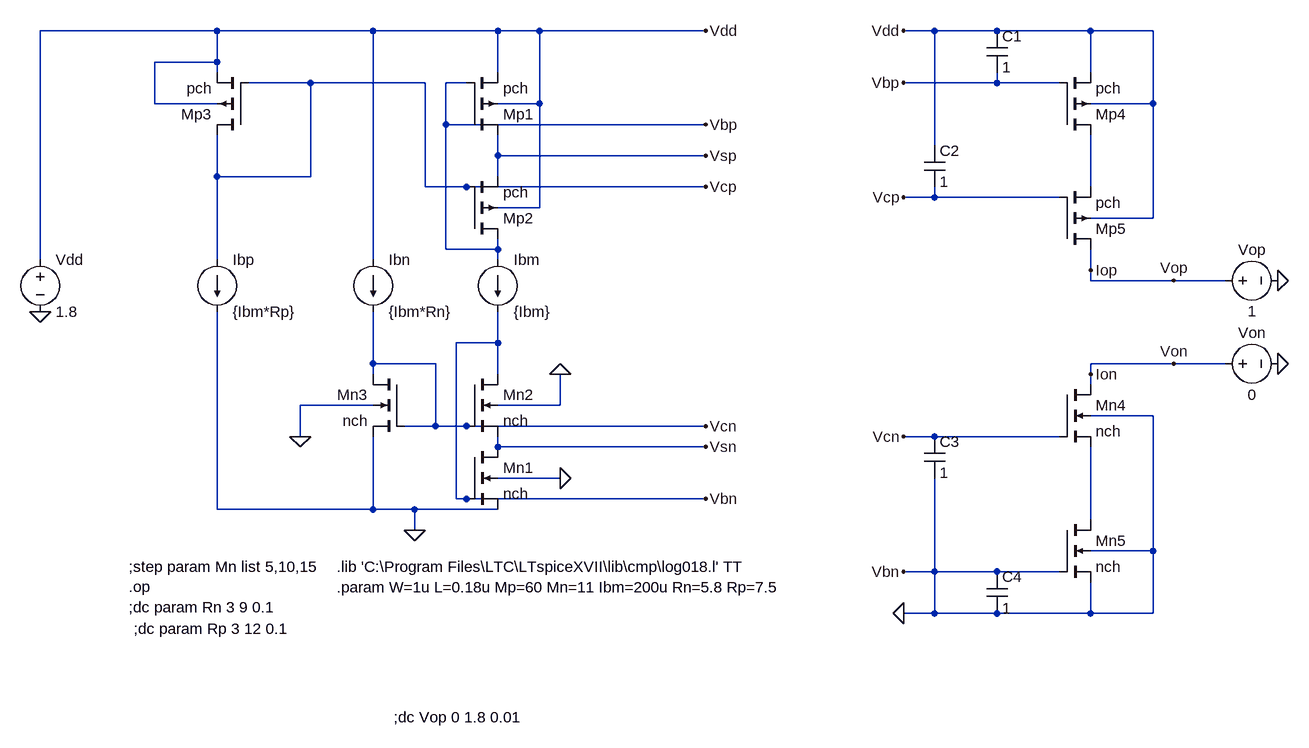
[diagram p0: schematic Simulation_1.asc]
Simulation_1.asc, the LTspice schematic file:
Version 4
SHEET 1 2628 800
WIRE 976 -272 704 -272
WIRE 1216 -272 976 -272
WIRE 1408 -272 1216 -272
WIRE 1472 -272 1408 -272
WIRE 1728 -272 1472 -272
WIRE 2080 -272 2032 -272
WIRE 2176 -272 2080 -272
WIRE 2320 -272 2176 -272
WIRE 2416 -272 2320 -272
WIRE 976 -224 976 -272
WIRE 976 -224 880 -224
WIRE 976 -208 976 -224
WIRE 1408 -208 1408 -272
WIRE 2320 -208 2320 -272
WIRE 1120 -192 1024 -192
WIRE 1296 -192 1120 -192
WIRE 1360 -192 1328 -192
WIRE 2176 -192 2176 -208
WIRE 2176 -192 2032 -192
WIRE 2272 -192 2176 -192
WIRE 880 -160 880 -224
WIRE 976 -160 880 -160
WIRE 1472 -160 1472 -272
WIRE 1472 -160 1408 -160
WIRE 2416 -160 2416 -272
WIRE 2416 -160 2320 -160
WIRE 1328 -128 1328 -192
WIRE 1728 -128 1328 -128
WIRE 2080 -96 2080 -272
WIRE 1408 -80 1408 -112
WIRE 1728 -80 1408 -80
WIRE 976 -48 976 -112
WIRE 1120 -48 1120 -192
WIRE 1120 -48 976 -48
WIRE 1408 -48 1408 -80
WIRE 1296 -32 1296 -192
WIRE 1360 -32 1296 -32
WIRE 1728 -32 1360 -32
WIRE 2320 -32 2320 -112
WIRE 2080 -16 2080 -32
WIRE 2080 -16 2032 -16
WIRE 2272 -16 2080 -16
WIRE 1472 0 1472 -160
WIRE 1472 0 1408 0
WIRE 2416 16 2416 -160
WIRE 2416 16 2320 16
WIRE 1328 64 1328 -128
WIRE 1408 64 1408 48
WIRE 1408 64 1328 64
WIRE 704 80 704 -272
WIRE 976 80 976 -48
WIRE 1216 80 1216 -272
WIRE 1408 80 1408 64
WIRE 2320 96 2320 64
WIRE 2320 112 2320 96
WIRE 2448 112 2320 112
WIRE 2528 112 2448 112
WIRE 1408 208 1408 160
WIRE 1408 208 1344 208
WIRE 1216 240 1216 160
WIRE 1312 240 1216 240
WIRE 2448 240 2320 240
WIRE 2528 240 2448 240
WIRE 1216 256 1216 240
WIRE 1408 256 1408 208
WIRE 2320 256 2320 240
WIRE 2320 272 2320 256
WIRE 1216 304 1104 304
WIRE 1504 304 1504 256
WIRE 1504 304 1408 304
WIRE 2416 320 2320 320
WIRE 1312 336 1312 240
WIRE 1312 336 1264 336
WIRE 1360 336 1312 336
WIRE 1728 336 1360 336
WIRE 1104 352 1104 304
WIRE 2080 352 2032 352
WIRE 2272 352 2080 352
WIRE 1408 368 1408 352
WIRE 1728 368 1408 368
WIRE 1504 416 1408 416
WIRE 1344 448 1344 208
WIRE 1360 448 1344 448
WIRE 1728 448 1360 448
WIRE 976 464 976 160
WIRE 1216 464 1216 352
WIRE 1216 464 976 464
WIRE 1280 464 1216 464
WIRE 1408 464 1280 464
WIRE 2320 480 2320 368
WIRE 1280 496 1280 464
WIRE 2416 528 2416 320
WIRE 2416 528 2320 528
WIRE 2080 560 2080 416
WIRE 2080 560 2032 560
WIRE 2176 560 2080 560
WIRE 2272 560 2176 560
WIRE 2080 624 2080 560
WIRE 2080 624 2032 624
WIRE 2176 624 2080 624
WIRE 2320 624 2320 576
WIRE 2320 624 2176 624
WIRE 2416 624 2416 528
WIRE 2416 624 2320 624
FLAG 704 160 0
FLAG 1104 352 0
FLAG 1280 496 0
FLAG 1504 256 0
FLAG 1504 416 0
FLAG 1728 -128 Vbp
FLAG 1728 -80 Vsp
FLAG 1728 -32 Vcp
FLAG 1728 336 Vcn
FLAG 1728 368 Vsn
FLAG 1728 448 Vbn
FLAG 1728 -272 Vdd
FLAG 2032 624 0
FLAG 2032 -272 Vdd
FLAG 2032 -192 Vbp
FLAG 2032 -16 Vcp
FLAG 2032 352 Vcn
FLAG 2032 560 Vbn
FLAG 2608 112 0
FLAG 2608 240 0
FLAG 2448 112 Vop
FLAG 2320 96 Iop
FLAG 2448 240 Von
FLAG 2320 256 Ion
DATAFLAG 1584 -128 ""
DATAFLAG 1584 -80 ""
DATAFLAG 1584 -32 ""
DATAFLAG 1600 336 ""
DATAFLAG 1600 368 ""
DATAFLAG 1600 448 ""
SYMBOL pmos4 1360 -112 M180
SYMATTR InstName Mp1
SYMATTR Value pch
SYMATTR Value2 l=L w=W m=Mp
SYMBOL pmos4 1360 48 M180
SYMATTR InstName Mp2
SYMATTR Value pch
SYMATTR Value2 l=L w=W m=Mp
SYMBOL pmos4 1024 -112 R180
SYMATTR InstName Mp3
SYMATTR Value pch
SYMATTR Value2 l={L} w={W} m={Mp}
SYMBOL nmos4 1360 368 R0
SYMATTR InstName Mn1
SYMATTR Value nch
SYMATTR Value2 l=L w=W m={Mn}
SYMBOL nmos4 1360 256 R0
SYMATTR InstName Mn2
SYMATTR Value nch
SYMATTR Value2 l=L w=W m={Mn}
SYMBOL nmos4 1264 256 M0
SYMATTR InstName Mn3
SYMATTR Value nch
SYMATTR Value2 l=L w=W m={Mn}
SYMBOL voltage 704 64 R0
SYMATTR InstName Vdd
SYMATTR Value 1.8
SYMBOL current 1408 80 R0
SYMATTR InstName Ibm
SYMATTR Value {Ibm}
SYMBOL current 1216 80 R0
WINDOW 123 0 0 Left 0
WINDOW 39 0 0 Left 0
SYMATTR InstName Ibn
SYMATTR Value {Ibm*Rn}
SYMBOL current 976 80 R0
WINDOW 123 0 0 Left 0
WINDOW 39 0 0 Left 0
SYMATTR InstName Ibp
SYMATTR Value {Ibm*Rp}
SYMBOL pmos4 2272 -112 M180
SYMATTR InstName Mp4
SYMATTR Value pch
SYMATTR Value2 l=L w=W m=Mp
SYMBOL pmos4 2272 64 M180
SYMATTR InstName Mp5
SYMATTR Value pch
SYMATTR Value2 l=L w=W m=Mp
SYMBOL nmos4 2272 272 R0
SYMATTR InstName Mn4
SYMATTR Value nch
SYMATTR Value2 l=L w=W m={Mn}
SYMBOL nmos4 2272 480 R0
SYMATTR InstName Mn5
SYMATTR Value nch
SYMATTR Value2 l=L w=W m={Mn}
SYMBOL cap 2160 -272 R0
SYMATTR InstName C1
SYMATTR Value 1
SYMBOL cap 2064 -96 R0
SYMATTR InstName C2
SYMATTR Value 1
SYMBOL cap 2064 352 R0
SYMATTR InstName C3
SYMATTR Value 1
SYMBOL cap 2160 560 R0
SYMATTR InstName C4
SYMATTR Value 1
SYMBOL voltage 2512 112 R270
WINDOW 0 32 56 VTop 2
WINDOW 3 -32 56 VBottom 2
WINDOW 123 0 0 Left 0
WINDOW 39 0 0 Left 0
SYMATTR InstName Vop
SYMATTR Value 1
SYMBOL voltage 2512 240 R270
WINDOW 0 32 56 VTop 2
WINDOW 3 -32 56 VBottom 2
WINDOW 123 0 0 Left 0
WINDOW 39 0 0 Left 0
SYMATTR InstName Von
SYMATTR Value 0
TEXT 1160 584 Left 2 !.param W=1u L=0.18u Mp=60 Mn=11 Ibm=200u Rn=5.8 Rp=7.5
TEXT 840 552 Left 2 !;step param Mn list 5,10,15\n.op\n;dc param Rn 3 9 0.1
TEXT 1160 552 Left 2 !.lib 'C:\\Program Files\\LTC\\LTspiceXVII\\lib\\cmp\\log018.l' TT
TEXT 848 648 Left 2 !;dc param Rp 3 12 0.1
TEXT 1248 784 Left 2 !;dc Vop 0 1.8 0.01

The netlist it stands for:
* Simulation_1.asc
Mp1 Vsp Vbp Vdd Vdd pch l=L w=W m=Mp
Mp2 Vbp Vcp Vsp Vdd pch l=L w=W m=Mp
Mp3 Vcp Vcp Vdd Vdd pch l={L} w={W} m={Mp}
Mn1 Vsn 0 0 0 nch l=L w=W m={Mn}
Mn2 0 Vcn Vsn 0 nch l=L w=W m={Mn}
Mn3 Vcn Vcn 0 0 nch l=L w=W m={Mn}
Vdd Vdd 0 1.8
Ibm Vbp 0 {Ibm}
Ibn Vdd Vcn {Ibm*Rn}
Ibp Vcp 0 {Ibm*Rp}
Mp4 N001 Vbp Vdd Vdd pch l=L w=W m=Mp
Mp5 Iop Vcp N001 Vdd pch l=L w=W m=Mp
Mn4 Ion Vcn N002 0 nch l=L w=W m={Mn}
Mn5 N002 0 0 0 nch l=L w=W m={Mn}
C1 Vdd Vbp 1
C2 Vdd Vcp 1
C3 Vcn 0 1
C4 0 0 1
Vop Iop 0 1
Von Ion 0 0
.model NMOS NMOS
.model PMOS PMOS
.lib standard.mos
.param W=1u L=0.18u Mp=60 Mn=11 Ibm=200u Rn=5.8 Rp=7.5
;step param Mn list 5,10,15
.op
;dc param Rn 3 9 0.1
.lib 'C:\Program Files\LTC\LTspiceXVII\lib\cmp\log018.l' TT
;dc param Rp 3 12 0.1
;dc Vop 0 1.8 0.01
.backanno
.end